# EAGLE board DistributedVisionSchematicPage1_3 4VER2 (EAGLE 9.6.2)
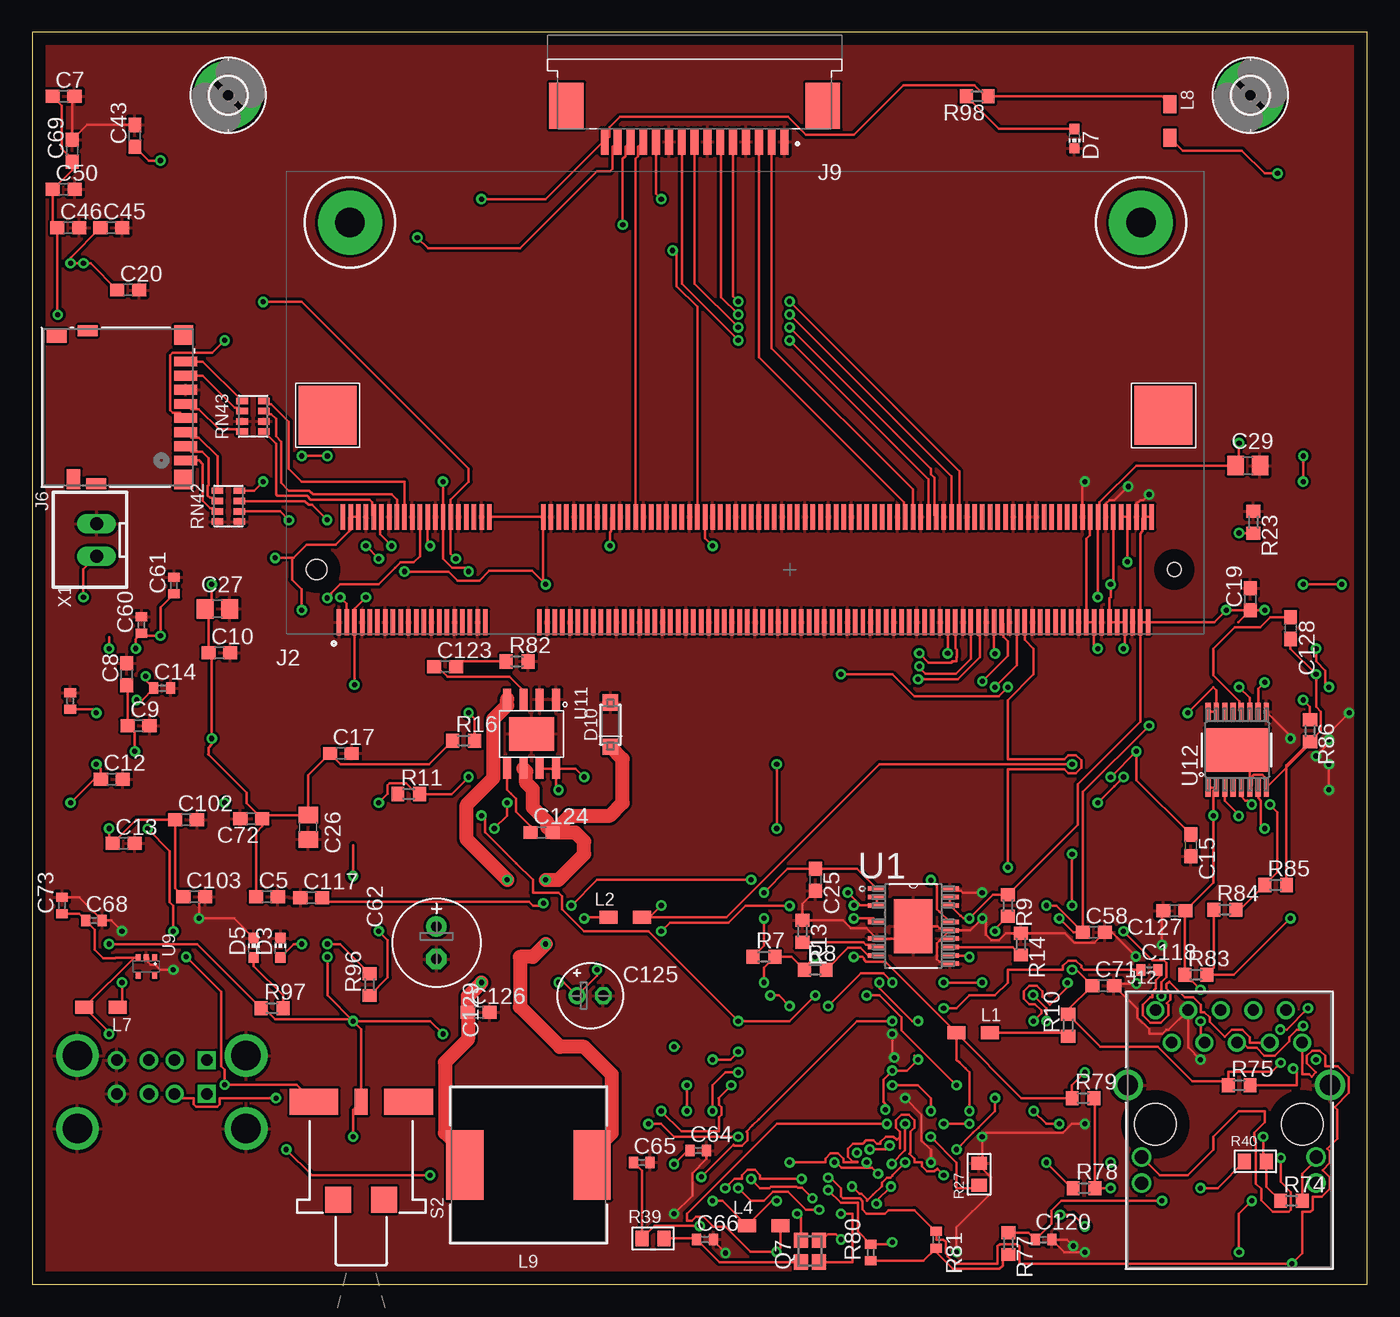
[diagram p4: board, top side]
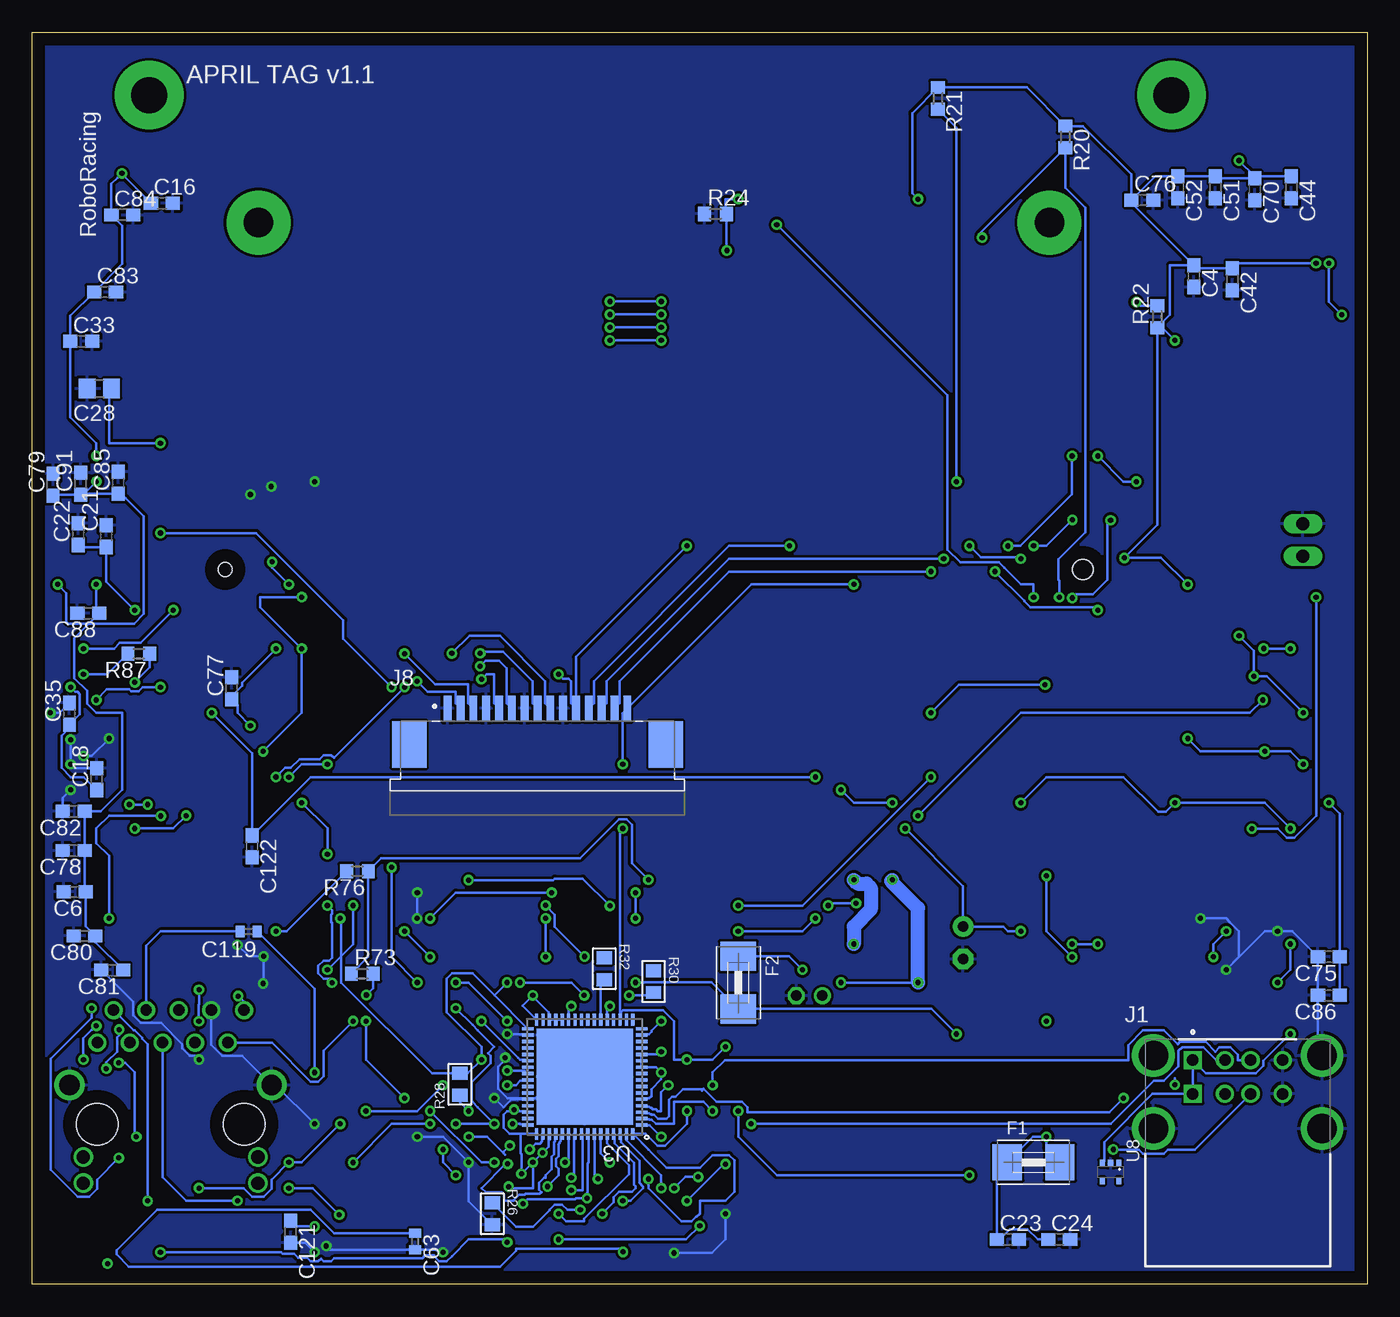
[diagram p5: board, bottom side, seen from below]

Size 104 x 97.5 mm. Coordinates in mm from the lower left corner, seen from the top.
Outline: 0,0 104,0 104,97.5 0,97.5 0,0
Copper layers (1*16): Top 0.035mm / dielectric 1.5mm / Bottom 0.035mm
Design rules "default": minimum track width 6mil, minimum drill 0.35mm, track to track 6mil, track to pad 6mil, pad to pad 6mil, via to via 6mil, smd to smd 6mil, copper to edge 40mil, drill to drill 6mil, minimum pad ring 10mil, minimum via ring 8mil, stop-mask expansion 4mil, vias tented up to drill 0mil, thermal gap 10mil
Net classes: 0 default: width 0.203 mm, drill 0.4 mm, clearance 0.203 mm; 1 power: width 0.203 mm, drill 0.4 mm, clearance 0.203 mm to class 0, clearance 0.203 mm; 2 ethernet: width 0.16 mm, drill 0.3 mm, clearance 0.152 mm; 3 spi: width 0.207 mm, drill 0.35 mm

## Footprints (pad centres in the part's own frame; a part is rotated, then mirrored left to right if it is on the bottom)
C0603 = smd 1.1 x 1: 1 -0.85,0; 2 0.85,0
C0402 = smd 0.7 x 0.9: 1 -0.65,0; 2 0.65,0
C0805 = smd 1.3 x 1.5: 1 -0.95,0; 2 0.95,0
E2-5 = drill 0.813 pad 1.27: + -1.016,0 | drill 0.813 pad 1.27 octagon: - 1.016,0
E2,5-7 = drill 0.813 pad 1.6: + -1.27,0 | drill 0.813 pad 1.6 octagon: - 1.27,0
CHIP-LED0603 = smd 0.8 x 0.8: A 0,-0.75; C 0,0.75
SOD123FL_DIO = smd 1.25 x 1.22: 1 -1.725,0; 2 1.725,0
1812 = smd 2.286 x 2.794: 1 -2.046,0; 2 2.046,0
2,8-PAD = drill 2.8 pad 5.334: B2,8 0,0
SAMTEC_USBR-A-D-F-O-TH = drill 0.9 square: A01 0,0; B01 0,-2.62 | drill 0.9: A02 2.5,0; A03 4.5,0; A04 7,0; B02 2.5,-2.62; B03 4.5,-2.62; B04 7,-2.62 | drill 2.3: S1 -3.07,0.35; S2 10.07,0.35; S3 10.07,-5.33; S4 -3.07,-5.33
TE_1473149-4_WITH_CM3PLUS = smd 0.35 x 2: 1 -35.1,-4.1; 2 -34.8,4.1; 3 -34.5,-4.1; 4 -34.2,4.1; 5 -33.9,-4.1; 6 -33.6,4.1; 7 -33.3,-4.1; 8 -33,4.1; 9 -32.7,-4.1; 10 -32.4,4.1; 11 -32.1,-4.1; 12 -31.8,4.1; 13 -31.5,-4.1; 14 -31.2,4.1; 15 -30.9,-4.1; 16 -30.6,4.1; 17 -30.3,-4.1; 18 -30,4.1; 19 -29.7,-4.1; 20 -29.4,4.1; 21 -29.1,-4.1; 22 -28.8,4.1; 23 -28.5,-4.1; 24 -28.2,4.1; 25 -27.9,-4.1; 26 -27.6,4.1; 27 -27.3,-4.1; 28 -27,4.1; 29 -26.7,-4.1; 30 -26.4,4.1; 31 -26.1,-4.1; 32 -25.8,4.1; 33 -25.5,-4.1; 34 -25.2,4.1; 35 -24.9,-4.1; 36 -24.6,4.1; 37 -24.3,-4.1; 38 -24,4.1; 39 -23.7,-4.1; 40 -23.4,4.1; 41 -19.5,-4.1; 42 -19.2,4.1; 43 -18.9,-4.1; 44 -18.6,4.1; 45 -18.3,-4.1; 46 -18,4.1; 47 -17.7,-4.1; 48 -17.4,4.1; 49 -17.1,-4.1; 50 -16.8,4.1; 51 -16.5,-4.1; 52 -16.2,4.1; 53 -15.9,-4.1; 54 -15.6,4.1; 55 -15.3,-4.1; 56 -15,4.1; 57 -14.7,-4.1; 58 -14.4,4.1; 59 -14.1,-4.1; 60 -13.8,4.1; 61 -13.5,-4.1; 62 -13.2,4.1; 63 -12.9,-4.1; 64 -12.6,4.1; 65 -12.3,-4.1; 66 -12,4.1; 67 -11.7,-4.1; 68 -11.4,4.1; 69 -11.1,-4.1; 70 -10.8,4.1; 71 -10.5,-4.1; 72 -10.2,4.1; 73 -9.9,-4.1; 74 -9.6,4.1; 75 -9.3,-4.1; 76 -9,4.1; 77 -8.7,-4.1; 78 -8.4,4.1; 79 -8.1,-4.1; 80 -7.8,4.1; 81 -7.5,-4.1; 82 -7.2,4.1; 83 -6.9,-4.1; 84 -6.6,4.1; 85 -6.3,-4.1; 86 -6,4.1; 87 -5.7,-4.1; 88 -5.4,4.1; 89 -5.1,-4.1; 90 -4.8,4.1; 91 -4.5,-4.1; 92 -4.2,4.1; 93 -3.9,-4.1; 94 -3.6,4.1; 95 -3.3,-4.1; 96 -3,4.1; 97 -2.7,-4.1; 98 -2.4,4.1; 99 -2.1,-4.1; 100 -1.8,4.1; 101 -1.5,-4.1; 102 -1.2,4.1; 103 -0.9,-4.1; 104 -0.6,4.1; 105 -0.3,-4.1; 106 0,4.1; 107 0.3,-4.1; 108 0.6,4.1; 109 0.9,-4.1; 110 1.2,4.1; 111 1.5,-4.1; 112 1.8,4.1; 113 2.1,-4.1; 114 2.4,4.1; 115 2.7,-4.1; 116 3,4.1; 117 3.3,-4.1; 118 3.6,4.1; 119 3.9,-4.1; 120 4.2,4.1; 121 4.5,-4.1; 122 4.8,4.1; 123 5.1,-4.1; 124 5.4,4.1; 125 5.7,-4.1; 126 6,4.1; 127 6.3,-4.1; 128 6.6,4.1; 129 6.9,-4.1; 130 7.2,4.1; 131 7.5,-4.1; 132 7.8,4.1; 133 8.1,-4.1; 134 8.4,4.1; 135 8.7,-4.1; 136 9,4.1; 137 9.3,-4.1; 138 9.6,4.1; 139 9.9,-4.1; 140 10.2,4.1; 141 10.5,-4.1; 142 10.8,4.1; 143 11.1,-4.1; 144 11.4,4.1; 145 11.7,-4.1; 146 12,4.1; 147 12.3,-4.1; 148 12.6,4.1; 149 12.9,-4.1; 150 13.2,4.1; 151 13.5,-4.1; 152 13.8,4.1; 153 14.1,-4.1; 154 14.4,4.1; 155 14.7,-4.1; 156 15,4.1; 157 15.3,-4.1; 158 15.6,4.1; 159 15.9,-4.1; 160 16.2,4.1; 161 16.5,-4.1; 162 16.8,4.1; 163 17.1,-4.1; 164 17.4,4.1; 165 17.7,-4.1; 166 18,4.1; 167 18.3,-4.1; 168 18.6,4.1; 169 18.9,-4.1; 170 19.2,4.1; 171 19.5,-4.1; 172 19.8,4.1; 173 20.1,-4.1; 174 20.4,4.1; 175 20.7,-4.1; 176 21,4.1; 177 21.3,-4.1; 178 21.6,4.1; 179 21.9,-4.1; 180 22.2,4.1; 181 22.5,-4.1; 182 22.8,4.1; 183 23.1,-4.1; 184 23.4,4.1; 185 23.7,-4.1; 186 24,4.1; 187 24.3,-4.1; 188 24.6,4.1; 189 24.9,-4.1; 190 25.2,4.1; 191 25.5,-4.1; 192 25.8,4.1; 193 26.1,-4.1; 194 26.4,4.1; 195 26.7,-4.1; 196 27,4.1; 197 27.3,-4.1; 198 27.6,4.1; 199 27.9,-4.1; 200 28.2,4.1 | smd 4.5 x 4.6: 201 -36,12; 202 29.1,12 | drill 2.3 pad 5: MH1 -34.25,27; MH2 27.35,27 | hole 1.6: -36.85,0 | hole 1.1: 29.95,0
CONN8_DM3D-SF_HIR = smd 0.762 x 1.803: 1 -4.149,-5.271; 2 -3.049,-5.271; 3 -1.949,-5.271; 4 -0.849,-5.271; 5 0.251,-5.271; 6 1.351,-5.271; 7 2.451,-5.271; 8 3.551,-5.271 | smd 1.499 x 1.499: 9 -5.625,-5.118; 10 5.625,-5.118 | smd 0.838 x 1.549: 11 -5.955,1.706; 12 5.955,2.356 | smd 1.549 x 1.041: 13 -5.6,3.46 | smd 1.041 x 1.549: 14 5.554,4.781
TE_1-84952-5 = smd 0.61 x 2: 1 -7,0; 2 -6,0; 3 -5,0; 4 -4,0; 5 -3,0; 6 -2,0; 7 -1,0; 8 0,0; 9 1,0; 10 2,0; 11 3,0; 12 4,0; 13 5,0; 14 6,0; 15 7,0 | smd 2.68 x 3.6: S1 -9.99,-2.8; S2 9.99,-2.8
CONN_EW_ABR = drill 0.89 pad 1.397: 1 5.715,0; 2 4.445,2.54; 3 3.175,0; 4 1.905,2.54; 6 -0.635,2.54; 7 -1.905,0; 8 -3.175,2.54; 9 -4.445,0; 10 -5.715,2.54 | drill 0.889 pad 1.397: 5 0.635,0 | drill 1.57 pad 2.083: CH1 -7.875,-3.3; CH2 7.875,-3.3 | drill 1.02 pad 1.524: L1 -6.8,-8.9; L2 -6.8,-10.93; L3 6.8,-8.9; L4 6.8,-10.93 | hole 3.25: 5.715,-6.35; -5.715,-6.35
0805 = smd 1.4 x 1: 1 -1.3,0; 2 1.3,0
WE-PD_1210 = smd 2.9 x 5.4: 1 -4.95,0; 2 4.95,0
FA-20H = smd 1.2 x 1.1: 1 -0.85,-0.7; 2 0.85,-0.7; 3 0.85,0.7; 4 -0.85,0.7
R0603 = smd 1 x 1.1: 1 -0.85,0; 2 0.85,0
RC0805N = smd 1.006 x 1.2: 1 -0.853,0; 2 0.853,0
R0402 = smd 0.7 x 0.9: 1 -0.65,0; 2 0.65,0
RA-4_1206 = smd 0.5 x 0.9: 1 -1.2,-0.85; 2 -1.2,0.85; 3 -0.4,-0.85; 4 -0.4,0.85; 5 0.4,-0.85; 6 0.4,0.85; 7 1.2,-0.85; 8 1.2,0.85
34EWMSP12M6RT = smd 3.81 x 2.03: 1 -3.685,0; 3 3.685,0 | smd 1.02 x 2.03: 2 0,0 | smd 2.03 x 2.03: LEG1 -1.78,7.62; LEG3 1.78,7.62
SOP65P640X175-21N = smd 1.422 x 0.356: 1 -2.845,2.921; 2 -2.845,2.286; 3 -2.845,1.626; 5 -2.845,0.33; 7 -2.845,-0.965; 8 -2.845,-1.626; 9 -2.845,-2.286; 11 2.845,-2.921; 12 2.845,-2.286; 13 2.845,-1.626; 14 2.845,-0.965; 15 2.845,-0.33; 16 2.845,0.33; 18 2.845,1.626; 19 2.845,2.286; 20 2.845,2.921 | smd 2.997 x 4.191: 21 0,0
QFN64_9X9MC_MCH-M = smd 0.908 x 0.255: 1 -4.442,3.75; 2 -4.442,3.25; 3 -4.442,2.75; 4 -4.442,2.25; 5 -4.442,1.75; 6 -4.442,1.25; 7 -4.442,0.75; 8 -4.442,0.25; 9 -4.442,-0.25; 10 -4.442,-0.75; 11 -4.442,-1.25; 12 -4.442,-1.75; 13 -4.442,-2.25; 14 -4.442,-2.75; 15 -4.442,-3.25; 16 -4.442,-3.75; 33 4.442,-3.75; 34 4.442,-3.25; 35 4.442,-2.75; 36 4.442,-2.25; 37 4.442,-1.75; 38 4.442,-1.25; 39 4.442,-0.75; 40 4.442,-0.25; 41 4.442,0.25; 42 4.442,0.75; 43 4.442,1.25; 44 4.442,1.75; 45 4.442,2.25; 46 4.442,2.75; 47 4.442,3.25; 48 4.442,3.75 | smd 0.255 x 0.908: 17 -3.75,-4.442; 18 -3.25,-4.442; 19 -2.75,-4.442; 20 -2.25,-4.442; 21 -1.75,-4.442; 22 -1.25,-4.442; 23 -0.75,-4.442; 24 -0.25,-4.442; 25 0.25,-4.442; 26 0.75,-4.442; 27 1.25,-4.442; 28 1.75,-4.442; 29 2.25,-4.442; 30 2.75,-4.442; 31 3.25,-4.442; 32 3.75,-4.442; 49 3.75,4.442; 50 3.25,4.442; 51 2.75,4.442; 52 2.25,4.442; 53 1.75,4.442; 54 1.25,4.442; 55 0.75,4.442; 56 0.25,4.442; 57 -0.25,4.442; 58 -0.75,4.442; 59 -1.25,4.442; 60 -1.75,4.442; 61 -2.25,4.442; 62 -2.75,4.442; 63 -3.25,4.442; 64 -3.75,4.442 | smd 7.493 x 7.493: 65 0,0
SC70-5 = smd 0.5 x 0.4: 1 -0.7,0.65; 2 -0.7,0; 3 -0.7,-0.65; 4 0.7,-0.65; 6 0.7,0.65
SOIC-8-EXPOSED_PAD = smd 1.6 x 0.61: 1 -2.7,1.905; 2 -2.7,0.635; 3 -2.7,-0.635; 4 -2.7,-1.905; 5 2.7,-1.905; 6 2.7,-0.635; 7 2.7,0.635; 8 2.7,1.905 | smd 2.62 x 3.51: 9 0,0
PWP0016H_N = smd 1.4 x 0.4: 1 -2.95,2.275; 2 -2.95,1.625; 3 -2.95,0.975; 4 -2.95,0.325; 5 -2.95,-0.325; 6 -2.95,-0.975; 7 -2.95,-1.625; 8 -2.95,-2.275; 9 2.95,-2.275; 10 2.95,-1.625; 11 2.95,-0.975; 12 2.95,-0.325; 13 2.95,0.325; 14 2.95,0.975; 15 2.95,1.625; 16 2.95,2.275 | smd 3.4 x 5: 17 0,0
JST-XH-02-PACKAGE-LONG-PAD = drill 1.016 long: 1 -1.17,-0.5; 2 1.37,-0.5

## Placement (x,y rotation side)
C4  10nF  [C0603]  13.53,78.5 270 bottom
C5  100nF  [C0603]  18.29,30.18 0 top
C6  100nF  [C0603]  100.68,30.56 180 bottom
C7  10uF  [C0603]  2.45,92.5 0 top
C8  10nF  [C0603]  7.37,47.5 90 top
C9  10nF  [C0603]  8.29,43.5 0 top
C10  100nF  [C0603]  14.59,49.18 0 top
C12  10uF  [C0603]  6.21,39.34 0 top
C13  10nF  [C0603]  7.13,34.34 0 top
C14  1uF  [C0402]  10.13,46.42 0 top
C15  100nF  [C0603]  90.24,34.18 270 top
C16  100nF  [C0603]  93.89,84.18 0 bottom
C17  10uF  [C0603]  24.05,41.34 0 top
C18  10nF  [C0603]  98.97,39.34 90 bottom
C19  10nF  [C0603]  94.89,53.34 90 top
C20  10nF  [C0603]  7.49,77.42 0 top
C21  100nF  [C0603]  98.22,58.26 90 bottom
C22  10uF  [C0603]  100.41,58.42 90 bottom
C23  22uF  [C0603]  28,3.5 0 bottom
C24  22uF  [C0603]  24,3.5 0 bottom
C25  470nF  [C0603]  61,31.5 270 top
C26  22uF  [C0805]  21.51,35.59 270 top
C27  22uF  [C0805]  14.43,52.59 0 top
C28  22uF  [C0805]  98.76,69.75 180 bottom
C29  22uF  [C0805]  94.68,63.75 0 top
C33  10nF  [C0603]  100.17,73.42 0 bottom
C35  10uF  [C0603]  101.09,44.42 90 bottom
C42  100nF  [C0603]  10.52,78.26 270 bottom
C43  4.7uF  [C0603]  8.01,89.42 90 top
C44  4.7uF  [C0603]  5.93,85.42 270 bottom
C45  100nF  [C0603]  6.17,82.26 0 top
C46  100nF  [C0603]  2.82,82.26 0 top
C50  100nF  [C0603]  2.47,85.26 0 top
C51  10nF  [C0603]  11.85,85.42 270 bottom
C52  10nF  [C0603]  14.77,85.42 270 bottom
C58  10nF  [C0603]  82.69,27.42 0 top
C60  100nF  [C0402]  8.52,51.34 90 top
C61  10nF  [C0402]  11.05,54.42 90 top
C62  4.7uF  [C0402]  2.97,45.42 90 top
C63  100nF  [C0402]  74.17,3.34 270 bottom
C64  1uF  [C0402]  51.89,10.42 0 top
C65  33pF  [C0402]  47.49,9.5 0 top
C66  33pF  [C0402]  52.41,3.5 0 top
C68  100nF  [C0402]  4.82,28.34 0 top
C69  100nF  [C0603]  3.12,88.26 90 top
C70  100nF  [C0603]  8.77,85.26 270 bottom
C71  100nF  [C0603]  83.42,23.26 0 top
C72  100nF  [C0603]  17.07,36.26 180 top
C73  10uF  [C0402]  2.33,29.5 90 top
C75  10nF  [C0603]  3,25.5 180 bottom
C76  10nF  [C0603]  17.53,84.42 0 bottom
C77  10nF  [C0603]  88.45,46.42 90 bottom
C78  100nF  [C0603]  100.76,33.78 180 bottom
C79  100nF  [C0603]  102.37,62.26 90 bottom
C80  10nF  [C0603]  99.92,27.13 180 bottom
C81  100nF  [C0603]  97.76,24.48 180 bottom
C82  100nF  [C0603]  100.76,36.83 180 bottom
C83  100nF  [C0603]  98.32,77.26 0 bottom
C84  100nF  [C0603]  96.97,83.26 0 bottom
C85  10nF  [C0603]  97.29,62.42 90 bottom
C86  10nF  [C0603]  3,22.5 180 bottom
C88  100nF  [C0603]  99.62,52.26 180 bottom
C91  100nF  [C0603]  100.22,62.34 90 bottom
C102  10uF  [C0603]  11.99,36.18 0 top
C103  10uF  [C0603]  12.64,30.18 0 top
C117  10000pF  [C0603]  21.75,30.1 0 top
C118  10000pF  [C0402]  87.02,24.48 0 top
C119  10000pF  [C0402]  87.13,27.48 180 bottom
C120  0.1uF  [C0402]  78.78,3.48 0 top
C121  10000pF  [C0603]  83.86,4.1 270 bottom
C122  10000pF, 50V  [C0603]  86.87,34.1 270 bottom
C123  0.022uF, 50V  [C0603]  32.17,48.1 0 top
C124  0.220uF  [C0603]  39.68,35.18 0 top
C125  100uF  [E2-5]  43.47,22.48 0 top
C126  0.220uF  [C0603]  34.79,21.18 0 top
C127  1uF, 50V  [C0603]  88.97,29.1 180 top
C128  2.2uF, 50V  [C0603]  98.01,51.1 270 top
C129  100uF, 35V  [E2,5-7]  31.5,26.59 270 top
D3  GRN  [CHIP-LED0603]  19.34,26.21 0 top
D5  GRN  [CHIP-LED0603]  17.26,26.21 0 top
D7  GRN  [CHIP-LED0603]  81.18,89.21 180 top
D10  NTS260ESFT3G  [SOD123FL_DIO]  45.04,43.58 90 top
F1  2A  [1812]  26,9.5 0 bottom
F2  2A  [1812]  49,23.5 270 bottom
H1  MOUNT-PAD-ROUND2.8  [2,8-PAD]  94.88,92.59 0 top
H2  MOUNT-PAD-ROUND2.8  [2,8-PAD]  15.26,92.59 0 top
J1  USBR-A-D-F-O-TH  [SAMTEC_USBR-A-D-F-O-TH]  13.6,17.46 0 bottom
J2  RASPBERRRY_COMPUTE_CM3  [TE_1473149-4_WITH_CM3PLUS]  59.01,55.66 0 top
J6  DM3D-SF  [CONN8_DM3D-SF_HIR]  6.69,68.3 90 top
J8  1-84952-5  [TE_1-84952-5]  64.64,44.84 0 bottom
J9  1-84952-5  [TE_1-84952-5]  51.6,88.97 180 top
J12  ARJM11C7-104-AB-EW2  [CONN_EW_ABR]  93.21,18.82 0 top
L1  4A  [0805]  73.29,19.58 0 top
L2  4A  [0805]  46.21,28.58 0 top
L4  1.3A 120r  [0805]  56.99,4.58 0 top
L7  1.3A 120r  [0805]  5.37,21.58 180 top
L8  1.3A 120r  [0805]  88.61,90.58 270 top
L9  47uH  [WE-PD_1210]  38.66,9.3 180 top
Q7  25 MHz  [FA-20H]  60.59,2.59 90 top
R7  5.1k  [R0603]  57,25.5 0 top
R8  47k  [R0603]  61,24.5 0 top
R9  47k  [R0603]  76,29.5 270 top
R10  31.6k  [R0603]  80.69,20.18 90 top
R11  12.7k  [R0603]  29.34,38.18 0 top
R13  10k  [R0603]  60,27.5 270 top
R14  10k  [R0603]  77,26.5 270 top
R16  4.7k  [R0603]  33.61,42.34 0 top
R20  4.7k  [R0603]  23.53,89.34 270 bottom
R21  4.7k  [R0603]  33.45,92.34 270 bottom
R22  4.7k  [R0603]  16.37,75.34 90 bottom
R23  100k  [R0603]  95.12,59.34 270 top
R24  100k  [R0603]  50.77,83.34 0 bottom
R26  12k, 1.0%  [RC0805N]  68.16,5.5 270 bottom
R27  12.4k, 1.0%  [RC0805N]  73.76,8.58 90 top
R28  4.7k  [RC0805N]  70.68,15.58 90 bottom
R30  4.7k  [RC0805N]  55.6,23.58 270 bottom
R32  4.7k  [RC0805N]  59.44,24.58 270 bottom
R39  1M  [RC0805N]  48.36,3.58 0 top
R40  4.7k  [RC0805N]  95.28,9.58 0 top
R73  75, 1%  [R0603]  78.28,24.18 0 bottom
R74  470  [R0603]  98.09,6.5 0 top
R75  470  [R0603]  94.01,15.5 0 top
R76  75, 1%  [R0603]  78.66,32.18 180 bottom
R77  22, 1%  [R0603]  76.04,3.18 270 top
R78  10k  [R0603]  81.93,7.5 0 top
R79  10k  [R0603]  81.85,14.5 0 top
R80  49.9, 1%  [R0402]  65.31,2.48 90 top
R81  49.9, 1%  [R0402]  70.42,3.48 270 top
R82  22k  [R0603]  37.77,48.5 0 top
R83  715k, 1%  [R0603]  90.64,24.1 0 top
R84  20k, 1%  [R0603]  92.9,29.18 0 top
R85  30.1k, 1%  [R0603]  96.85,31.1 0 top
R86  11.8k, 1%  [R0603]  99.53,43.1 270 top
R87  66.5k, 1%  [R0603]  95.69,49.1 180 bottom
R96  4.7k  [R0603]  26.29,23.34 90 top
R97  330  [R0603]  18.69,21.5 0 top
R98  470  [R0603]  73.61,92.5 180 top
RN42  22  [RA-4_1206]  15.29,60.59 90 top
RN43  22  [RA-4_1206]  17.21,67.59 90 top
S2  34EWMSP12M6RT  [34EWMSP12M6RT]  25.63,14.22 180 top
U1  LM26420XMH  [SOP65P640X175-21N]  68.64,27.89 0 top
U3  LAN9513-JZXQFN64_9X9MC_MCH-M  [QFN64_9X9MC_MCH-M]  60.96,16.16 180 bottom
U8  SP3003-02  [SC70-5]  20,8.75 270 bottom
U9  SP3003-02  [SC70-5]  8.9,24.75 270 top
U11  IFX91041  [SOIC-8-EXPOSED_PAD]  38.9,42.86 270 top
U12  TPS26600PWPR  [PWP0016H_N]  93.86,41.62 90 top
X1  JST-XH-02-PIN-LONG-PAD  [JST-XH-02-PACKAGE-LONG-PAD]  4.52,57.86 90 top

## Tracks (layer width: path | path; a pad name or v marks a point on that pad's centre or on a via)
3V3_LED
  Top 0.203: R98.2 75.3,89.96 D7.A
5V_LED
  Top 0.203: R97.2 19.54,22.5 17.26,24.78 D5.A
5V_RAW  (via drill 0.4)
  Top 0.203: 41.53,34.97 40.74,34.97 C124.2 | v40,31.5
  Top 1.1: L9.1 43.61,10.25 45.16,11.8 45.16,16.34 43,18.5 41.11,18.5 38,21.61 38,25.5 39,25.5 v40,26.5 | v40,31.5 41,31.5 43,33.5 43,34.5 42.32,35.18 C124.2 | C124.2 40.13,35.58 40.13,35.99 39,37.12 39,38.52 38.48,39.05 38.48,39.95 U11.6 | C124.2 41.85,36.5 45,36.5 46,37.5 46,40.9 D10.1
  Bottom 1.1: v40,31.5 39.71,31.21 39,31.21 38.67,30.88 38.67,29.19 40,27.86 v40,26.5
24_LOAD  (via drill 0.4)
  Top 0.203: U12.10 95.48,46.36 v96,46.88
  Bottom 0.203: v96,46.88 94.84,48.04 R87.1
24V_LED  (via drill 0.4)
  Top 0.203: D3.A 20.38,26.5 v21,26.5 | v23,26.5 23.98,26.5 R96.2
  Bottom 0.203: v23,26.5 v21,26.5
+1.8V  (via drill 0.4)
  Top 0.203: J2.184 82.39,59.74 82.39,58.33 82.11,58.05 J2.183 J2.185 82.71,49.79 v83,49.5 | v94,65.5 94,64.02 C29.1 85.99,63.75 83.13,60.89 83.13,59.88 J2.186 v83.01,53.52 v83,53.51 | v34,39.5 32.68,38.18 R11.2 29.97,38.18 29.12,39.03 27.86,39.03 27.69,38.86 27.69,38.19 v27,37.5 | v49,29.5 48.08,28.58 L2.2 54.08,28.58 66,40.5 v81,40.5 | C15.1 86,39.27 v86,41.5 v84,39.5 | v6,35.5 6,34.62 C13.1 8.12,36.18 C102.1 11.14,30.83 C103.1
  Bottom 0.203: v94,65.5 98,65.5 98,69.56 C28.1 | v34,39.5 44,29.5 v49,29.5 | v86,41.5 83,44.5 v83,49.5 86.23,52.73 86.23,53.5 v83.01,53.5 v83,53.51 | v81,40.5 83,40.5 v84,39.5 | v6,35.5 8,37.5 v14.99,37.5 v15,37.5 15.71,36.79 16.29,36.79 19,39.5 25,39.5 v27,37.5
+3.3V  (via drill 0.4)
  Top 0.203: L8.1 87.99,92.5 R98.1 74.24,92.5 73.39,93.36 67.86,93.36 64,89.5 60.29,89.5 58.88,90.91 45.8,90.91 44.99,90.1 44.99,89.36 J9.15 44.47,88.97 40,84.5 v35,84.5 | C20.1 4.56,79.5 v4,79.5 v3,79.5 3,79.94 C45.1 | 1.97,75.47 v2,75.5 1.97,75.53 C46.1 1.62,82.61 C50.1 3.12,86.76 C69.1 3.12,87.63 2.31,88.43 2.31,91.78 C7.1 | J2.4 24.69,59.64 24.69,58.63 | 20.36,56.57 21.37,57.58 23.63,57.58 24.69,58.63 | 20.36,56.57 v18.93,56.57 | v14,54.5 14,53.11 C27.1 13.74,52.33 C10.1 14,48.92 v14,42.5 14,42.06 13.74,41.8 13.74,41.24 | 20.36,56.57 20.24,56.45 20.24,54.87 21,54.11 v21,52.5 | J2.4 24.81,58.75 24.69,58.63 | v29,55.5 32.42,55.5 33.13,54.79 34.84,54.79 35.61,55.56 38.94,55.56 v40,54.5 39.81,54.69 J2.42 J2.40 | v58,35.5 v58,40.5 | C58.1 81.84,38.34 v87,43.5 | R74.1 96.13,7.61 R40.2 95.88,9.83 v95.88,11.5 | C58.1 79.76,29.5 v79,29.5 | v81,24.5 81.33,24.5 C71.1 80.69,21.38 R10.2 83.22,18.5 87.67,18.5 90.35,15.82 92.84,15.82 R75.1 93.16,16.56 96.55,16.56 v97.24,17.26 | C58.1 81.08,27.42 v80,28.5 | C72.1 18.2,36.54 C26.1 21.51,39.65 C17.1 24.04,40.5 30.92,40.5 R16.1 | C72.1 16.71,37.47 16.71,38.27 13.74,41.24 | C72.1 17.92,35.66 17.44,35.18 C5.1 | v52.99,13.5 52.99,15.5 54,16.51 v54.99,16.51 v55,16.5 | 68.71,17.79 v69,17.5 68.14,16.64 v67,16.64 66.29,15.94 66.29,14.21 66.46,14.04 v66.46,13.61 | J2.4 J2.6 | J2.190 84.21,54.71 v84,54.5 84,53.5 83.91,53.41 J2.189 J2.191 J2.193 85.11,49.61 v85,49.5 | v85.3,56.25 85.3,59.65 J2.194 J2.192 | C43.1 9.08,87.5 v10,87.5 | J6.4 11.55,67.87 10.93,67.87 10.75,68.04 10.75,72.36 10.93,72.54 14.04,72.54 v15,73.5 | v8,41.5 8,42.94 C9.1 7.44,46.58 C8.1
  Top 0.203: v5,40.5 5.36,40.14 C12.1 4.84,39.34 v3,37.5 | 13.74,41.24 13.71,41.27 | v67.01,23.5 v67,23.5 66.29,24.21 64.55,24.21 v62,21.66 | v55,18.12 54.38,17.5 v53,17.5 | 50.38,18.5 v50,18.5 | v56,8.21 56.71,7.5 57.42,7.5 57.54,7.61 59.53,7.61 59.64,7.51 59.97,7.51 v60.78,6.71 | v65.77,6.27 65.77,6.5 v66.89,7.61 | v62.49,9.5 62.62,9.5 63.03,9.09 65.41,9.09 v65.89,8.62
  Bottom 0.203: v35,84.5 35.45,84.95 35.45,91.19 R21.1 26.53,93.19 R20.1 22.15,90.19 18.38,86.42 C76.1 | C76.1 16.53,86.27 C52.1 C51.1 11.69,86.11 C70.1 | C44.1 8.61,86.27 C70.1 | v4,79.5 10.13,79.5 C42.1 13.29,79.11 C4.1 | C76.1 18.38,84.2 C4.1 | C4.1 15.37,79.35 15.37,75.49 R22.1 | v3,79.5 3,76.5 v2,75.5 | R22.1 16.37,59.13 v18.93,56.57 16.07,56.57 v14,54.5 | v40,54.5 47.98,54.5 J8.15 58,44.48 v58,40.5 | v21,52.5 21.23,52.73 26.23,52.73 26.71,53.21 v29,55.5 | v58,35.5 58.21,35.29 U3.19 58.14,20.67 58.14,21.18 57.96,21.36 54.86,21.36 54,20.5 54,17.5 v53,17.5 51,17.5 v50,18.5 | 55.99,10.5 U3.64 | v85,49.5 87.64,46.85 87.64,46.59 88.45,45.79 C77.1 88,45.12 88,44.5 v87,43.5 | v79,29.5 79,26.5 v81,24.5 | v80,28.5 79.94,28.43 79.94,23.5 72.86,16.43 R28.2 70.07,16.43 v69,17.5 69,18.5 71.71,21.21 71.71,23.79 71.29,24.21 69.7,24.21 68,22.5 | v62,21.66 62.21,21.45 U3.27 | 66,13.5 67,13.5 67.29,13.21 67.29,12.21 66.8,11.72 66,11.72 | 66,13.5 65.98,13.48 65.47,13.48 U3.46 | U3.64 56.22,11.72 55.29,10.79 54.71,10.79 52.99,12.51 v52.99,13.5 | v67,16.64 65.64,16.64 U3.40 U3.39 | v84,54.5 85.3,55.8 v85.3,56.25 | U3.64 54.58,9.08 51.99,9.08 51,10.07 49.71,10.07 49.29,9.66 49.29,7.21 50,6.5 52,6.5 52,5.5 52.24,5.26 52.29,5.26 52.63,4.93 53.43,4.93 56,7.5 v56,8.21 | 60.64,9.5 | 60.64,9.5 60.64,11.65 U3.57 | v62.49,9.5 62.21,9.78 U3.54 | 66,13.5 66.11,13.61 v66.46,13.61 | U3.51 63.71,11.28 63.76,11.23 63.76,10.73 v64.24,10.25 v64.25,10.25 v65,9.5 | v10,87.5 8.77,86.27 C70.1 | v15,73.5 15.99,74.49 R22.1 | v14,42.5 13,41.5 v8,41.5 6,41.5 v5,40.5 | v95.88,11.5 96,11.62 96,16.5 96.76,17.26 v97.24,17.26
  Bottom 0.203: U3.33 68,22.5 | v67.01,23.5 68,22.51 68,22.5 | v55,18.12 55.21,17.91 U3.12 U3.11 U3.10 55.41,16.91 v55,16.5 55,15.96 55.76,15.2 55.76,14.66 55.94,14.48 56.45,14.48 U3.5 | 60.64,9.5 60.74,9.41 60.74,7.17 60.78,7.13 v60.78,6.71 61.64,6.71 61.71,6.63 65.41,6.63 v65.77,6.27 | C86.1 C75.1 2.15,36.65 v3,37.5 | v65,9.5 65,7.5 66.77,7.5 v66.89,7.61 | v65,9.5 v65.89,8.62 65.89,10.14 65.96,10.22 65.96,11.68 66,11.72 | 66,11.72 U3.49
+3.3V-A  (via drill 0.4)
  Top 0.203: v99,54.5 v102,54.5 | L8.2 89.61,88.28 94.22,88.28 96,86.5 v97,86.5 | v99,62.5 v99,64.49 v99.01,64.5
  Bottom 0.203: v99,54.5 99,52.49 C88.1 100.71,50.32 100.71,47.21 99.71,46.21 99.71,45.21 99,44.5 97,44.5 97,38.5 98.67,36.83 C82.1 C78.1 99.91,30.64 C6.1 99.83,27.89 C80.1 99.07,26.64 C81.1 | C91.1 102.29,61.49 C79.1 102.17,61.21 | C91.1 100.14,61.57 C85.1 97.07,61.57 96.71,61.21 95.29,59.79 95.29,52.21 96.04,51.45 101.15,51.45 101.33,51.63 101.33,53.83 v102,54.5 | C91.1 100.01,61.49 v99,62.5 | v99.01,64.5 99.01,65.49 101.02,67.5 C33.1 101.02,75.41 C83.1 96.97,79.47 96.97,82.41 C84.1 97.82,85.68 97.32,86.18 v97,86.5 97,86.44 C16.1
+3V3_A
  Top 0.203: R81.2 69.42,1.83 R80.1 | R81.2 70,2.41 | R77.2 75.59,1.88 75.59,1.45 75.35,1.21 71.71,1.21 70.42,2.5 R81.2
+5V  (via drill 0.4)
  Top 0.203: v25,31.81 25,34.2 | v25,20.5 23,22.5 v23,25.49 | L7.1 7,21.91 v7,23.5 | v6,26.5 12.84,26.5 R97.1 18.06,21.5 18.91,20.64 24.86,20.64 v25,20.5 | C19.1 93.96,51.56 | C19.1 v96,52.5 | v101,46.5 100.71,46.79 100.71,47.79 100,48.5 v100,49.5 | C19.1 v93,52.5 92.06,51.56 J2.199 J2.197 | J2.197 86.31,58.45 86.49,58.63 86.49,59.64 J2.198 J2.200 | U1.19 U1.18 72.3,28.7 72.32,28.7 72.53,28.5 v73,28.5 74.85,30.35 R9.1 81.43,35.78 81.43,38.94 86.31,43.81 J2.197 | U1.3 64.52,29.52 v63.53,30.5 | v25,20.5 25.63,19.87 S2.2 25,13.59 v25,11.5 | v25,20.5 31,20.5 v32,19.5 | v57,23.5 57,24.65 R7.2 59.15,25.5 R8.1 60.15,24.71 v60.97,25.53 | v64,29.51 U1.3 | U1.3 U1.2
  Bottom 0.203: v7,23.5 6,24.5 v6,26.5 | v23,25.49 25,27.49 v25,31.81 | C22.1 100.57,57.41 C21.1 98.22,54.72 v96,52.5 | v101,46.5 100.63,46.12 100.46,46.12 100.28,45.95 100.28,44.38 C35.1 101.09,43.33 101.71,42.71 101.71,40.21 101,39.5 99.98,39.5 C18.1 | v100,49.5 97.62,49.5 97.17,49.95 95.55,49.95 v93,52.5 | v63.53,30.5 71,30.5 v73,28.5 | v32,19.5 33.95,21.45 F2.2 51.08,23.54 56.33,23.54 56.36,23.5 v57,23.5 | C24.1 25.67,3.5 26.47,4.3 27.83,4.3 28.63,3.5 C23.1 28.85,8.7 F1.1 26.05,11.5 v25,11.5 25,10.55 F1.2 | v60.97,25.53 63.29,27.85 63.29,28.79 v64,29.5 v64,29.51
+5V_PREFUSE  (via drill 0.4)
  Top 0.203: v41,23.5 41.43,23.5 C125.+ 44,24.03 v44,24.5
  Top 1.1: L9.2 33.71,10.25 32.16,11.8 32.16,17.3 33.94,19.07 C126.1 33.94,22.44 v35,23.5 | v37,31.5 33.84,34.66 33.84,37.34 35.94,39.44 35.94,44.03 36.99,45.09 U11.4
  Bottom 0.203: v41,23.5 v35,23.5 | v44,24.5 45.05,25.55 F2.1
  Bottom 1.1: v35,23.5 35,29.29 37.1,31.4 v37,31.5
+24V  (via drill 0.4)
  Top 0.203: U12.7 95.48,37.88 95.71,37.66 95.71,35.79 v96,35.5 | U12.1 U12.2 92,38.44 v92,36.5 92,31.28 C127.1 89.79,29.07 R83.1 90.31,23.59 90.36,23.59 v91,22.94 | J12.7 91.01,19.11 v91.01,20.49
  Bottom 0.203: v96,35.5 93,35.5 v92,36.5 | v91,22.94 91,21.81 91.04,21.78 91.04,20.94 91.01,20.92 v91.01,20.49
+24V_FUSE  (via drill 0.4)
  Top 0.203: U11.7 U11.8 | U11.8 42.34,40.16 v43,39.5 | v36,35.5 37,36.5 v37,37.5 | v41,38.5 40.8,38.7 U11.8 | v90,44.5 92,46.5 92.23,46.27 U12.15 U12.16 | v27,27.51 v27,27.5 27.71,26.79 27.71,23.91 R96.1
  Bottom 0.203: v43,39.5 82.32,39.5 C122.1 86.87,41.37 v90,44.5 | v36,35.5 31.5,31 C129.+ 28.36,27.86 28.01,27.51 v27,27.51 | v37,37.5 40,37.5 v41,38.5
BVCC  (via drill 0.4)
  Top 0.203: X1.1 4,55.67 v4,53.5 | S2.3 20.62,15.55 v15,15.55 15,16.7 14.71,17 14.71,22.79 v12,25.5 | v11,27.5 11,29.49 10.73,29.75 10.73,33.74 v9,35.47
  Bottom 0.203: 15,16.06 v15,15.55 | v12,25.5 12,26.5 v11,27.5 | v9,35.47 6.97,35.47 6.29,34.79 5.71,34.79 4,36.5 v4,53.5
CAM0_CN  (via drill 0.4)
  Top 0.203: J2.144 70.29,59.88 70.29,62.78 70,63.08 70,63.51 v59,74.51 | v55,74.51 51.6,77.91 J9.8
  Bottom 0.203: v59,74.51 v55,74.51
CAM0_CP  (via drill 0.4)
  Top 0.203: J2.142 69.81,62.69 v59,73.5 | v55,73.5 50.6,77.9 J9.9
  Bottom 0.203: v59,73.5 v55,73.5
CAM0_DN0
  Top 0.203: J2.138 68.61,61.89 57.6,72.9 J9.2
CAM0_DN1  (via drill 0.4)
  Top 0.203: J2.150 72.21,63.32 v59,76.53 | v55,76.53 54.6,76.93 J9.5
  Bottom 0.203: v59,76.53 v55,76.53
CAM0_DP0
  Top 0.203: J2.136 67.89,59.88 67.89,60.89 56.6,72.18 J9.3
CAM0_DP1  (via drill 0.4)
  Top 0.203: J2.148 71.61,62.91 v59,75.52 | J9.6 53.66,88.97 53.66,76.86 v55,75.52
  Bottom 0.203: v59,75.52 v55,75.52
CAM0_IO0  (via drill 0.4)
  Top 0.203: J9.11 48.6,84.9 v49,84.5 | J2.82 51.81,76.11 50.19,77.73 50.19,80.2 v49.89,80.5
  Bottom 0.203: v49,84.5 50,84.5 50,83.42 R24.2 49.92,80.53 v49.89,80.5
CAM0_IO1
  Top 0.203: J9.12 47.21,88.58 47.21,87.84 47.01,87.64 J2.66
CAM0_SCL  (via drill 0.4)
  Top 0.203: v26,53.5 25.11,52.61 J2.5 v25.11,46.69 | J9.13 46.21,88.58 46.21,87.84 46,87.63 v46,82.5 | v34,44.5 34.46,44.04 R16.2
  Bottom 0.203: v46,82.5 32.71,69.21 32.71,57.21 31.71,56.21 28.71,56.21 28.29,55.79 27,54.5 26,54.5 v26,53.5 | v25.11,46.69 31.81,46.69 v34,44.5
CAM0_SDA  (via drill 0.4)
  Top 0.203: J9.14 45.21,88.58 45.21,86.84 45.03,86.67 44,86.67 38,80.67 30.84,80.67 v30,81.5 | v24,53.5 24.51,52.99 J2.3
  Bottom 0.203: v30,81.5 30.26,81.76 R20.2 23.53,85.4 21.95,83.82 21.95,58.58 24.08,56.45 24.08,54.87 24,54.79 v24,53.5
CAM1_CN  (via drill 0.4)
  Top 0.203: v69.1,49.14 69.82,48.42 71.6,48.42 71.68,48.5 72,48.5 72,48.82 72.02,48.83 72.02,49.42 71.91,49.53 J2.149
  Bottom 0.203: J8.8 65.03,45.23 65.03,46.97 67.32,49.26 68.98,49.26 v69.1,49.14
CAM1_CP  (via drill 0.4)
  Top 0.203: v71.31,49.13 J2.147
  Bottom 0.203: J8.9 64.03,45.23 64.03,46.97 67.56,50.5 69.94,50.5 v71.31,49.13
CAM1_DN0  (via drill 0.4)
  Top 0.203: J2.161 75.63,51.44 75.63,50.43 76,50.06 76,48.95 v74.01,46.96
  Bottom 0.203: J8.2 71.03,45.23 71.03,46.15 73.19,46.15 v74.01,46.96
CAM1_DN1  (via drill 0.4)
  Top 0.203: v69,47.12 72.1,47.12 73.82,48.83 73.82,50.42 73.71,50.53 J2.155
  Bottom 0.203: J8.5 68.03,45.23 68.03,47.47 68,47.5 68.62,47.5 v69,47.12
CAM1_DP0  (via drill 0.4)
  Top 0.203: v75,49.11 74.91,49.2 J2.159
  Bottom 0.203: J8.3 70.03,45.23 70.03,46.73 72.63,46.73 v75,49.11
CAM1_DP1  (via drill 0.4)
  Top 0.203: J2.153 73.11,48.7 71.95,47.55 69.57,47.55 69.29,47.83 69,47.83 69,48.02 v69.11,48.13
  Bottom 0.203: J8.6 67.03,45.23 67.03,47.97 67.61,48.55 68.69,48.55 v69.11,48.13
CAM1_IO0  (via drill 0.4)
  Top 0.203: v53,57.5 52.41,58.09 J2.84 | v63,47.5 67,47.5 68.71,45.79 75.29,45.79 v76,46.5 | v94,58.5 R23.2
  Bottom 0.203: v53,57.5 61.64,48.86 J8.11 62.03,45.23 62.03,46.97 62.21,47.15 62.64,47.15 v63,47.5 | v94,58.5 86.55,58.5 79.77,51.73 79.77,50.27 v76,46.5
CAM1_IO1  (via drill 0.4)
  Top 0.203: v45,57.5 45,58.54 45.09,58.63 45.09,59.64 J2.60
  Bottom 0.203: J8.12 60.25,45.23 60.25,46.97 49.72,57.5 v45,57.5
CAM1_SCL  (via drill 0.4)
  Top 0.203: v18,76.5 21,76.5 34,63.5 34,62.5 32.61,61.11 J2.30 32.61,56.89 v33,56.5
  Bottom 0.203: v18,76.5 17.69,76.19 R22.2 | J8.13 59.25,45.23 59.25,46.97 49.72,56.5 v33,56.5
CAM1_SDA  (via drill 0.4)
  Top 0.203: v32,62.5 J2.28 32.01,56.49 32.71,55.79 33.71,55.79 v34,55.5
  Bottom 0.203: R21.2 32,90.04 v32,62.5 | J8.14 58.25,45.23 58.25,46.97 49.72,55.5 v34,55.5
CT  (via drill 0.4)
  Top 0.203: R77.1 77.58,4.03 C120.1 79.37,4.72 79.37,5.72 80.16,6.51 v88,6.51 | v99,20.12 98.7,19.82 98.51,19.82 97.92,19.24 97.92,18.94 96.8,17.82 95.97,17.82 95.37,18.41 94.68,18.41 94.27,18.82 J12.5
  Bottom 0.203: v88,6.51 92.01,6.51 93.84,8.35 J12.5 | v99,20.12 99.3,19.82 99.34,19.82 100,19.16 v100,17.5
FB1
  Top 0.203: L1.2 80.44,19.58 R10.1
G_LED+  (via drill 0.4)
  Top 0.203: v97.24,9.85 97.24,7.98 98.05,7.18 98.05,5.82 97.87,5.64 96.61,5.64 95.73,6.53 95.73,7.44 95.33,7.84 95.33,11.05 95.17,11.21 95.17,11.79 96,12.62 96,13.5 93.99,13.5 92,11.5 92,10.5 90,8.5 87.83,8.5 J12.L1 | v99.37,21.5 97.7,19.84 v97.21,19.84 | v98.22,16.8 98.52,16.5 98.52,15.5 R75.2
  Bottom 0.203: v99.37,21.5 99.37,20.76 102.57,17.56 102.57,8.93 100.45,6.82 99.57,6.82 98.94,7.45 98.94,8.15 v97.24,9.85 | v97.21,19.84 97.21,19.41 97.39,19.24 97.39,18.11 98.22,17.28 v98.22,16.8
GND  (via drill 0.4)
  Top 0.203: J2.182 81.81,62.31 v82,62.5 | v85.37,62.13 84.31,61.06 83.91,61.06 83.61,60.77 J2.188 | v87,61.5 86.56,61.06 86.31,61.06 86.01,60.77 J2.196 | v70,9.5 70,10.48 69.28,11.2 69.28,13.22 v68,14.5 | 73.91,9.59 74,9.67 v74,11.5 74.29,11.79 80.29,11.79 81,12.5 v82,12.5 | 73.91,9.59 R27.2 | v82,2.5 80.41,2.5 C120.2 80.6,3.48 v81.09,2.99 | v72,2.5 72,4.43 74.67,7.1 74.67,8.36 73.91,9.11 73.91,9.59 | v91,17.5 90.03,18.46 J12.8 88.5,19.82 88.35,19.82 88.03,19.5 87,19.5 87,19.86 86.08,20.78 86.08,21.45 C71.2 84.43,23.42 v86,23.42 | C43.2 4.28,90.27 C69.2 3.12,92.32 C7.2 | C73.2 3.66,30.15 C68.2 6.17,28.34 v7,27.51 | v11,24.5 9.98,24.5 9.59,24.89 9.22,24.89 9.05,25.07 9.05,25.3 U9.2 | C103.2 13,29.69 v13,28.5 15.72,28.5 D5.C | v50,5.5 51.42,6.92 51.42,8.67 52.54,9.79 C64.2 | v54,2.45 53.06,3.39 C66.2 | C25.2 60,29.65 R13.1 63.15,28.35 63.76,27.74 64.98,27.74 U1.7 67.67,26.93 U1.21 70.5,27.89 70.65,27.74 71.31,27.74 U1.15 | U1.11 71.33,25.12 70.65,25.12 70.47,25.3 70.47,26.57 70.65,26.75 70.67,26.75 U1.15 | U1.15 73.07,27.56 v74.01,28.5 74.29,28.22 74.29,27.21 74.71,26.79 75.29,26.79 75.85,27.35 R14.1 80.43,27.35 81.16,26.61 82.73,26.61 C58.2 84.08,27.42 v85.96,25.54 | v74,30.5 72.48,30.5 72.32,30.66 71.64,30.66 U1.20 | v88,26.42 88,28.98 C127.2 | v101,38.5 v101,40.5 | v102.58,44.5 101,42.92 v101,42.41 101,42.14 v100,41.14 | U12.9 98,42.7 v98,42.5 | v67.16,17.65 66.99,17.82 v66.99,19.49
  Bottom 0.203: U3.44 65.33,14.48 64.82,14.48 63.14,16.16 U3.65 | 67.98,14.48 v68,14.5 67.29,13.79 66.67,14.41 U3.44 | v74,11.5 72,11.5 v70,9.5 70,6.49 R26.2 | C121.2 82.75,3.25 v82,2.5 | v81.09,2.99 80.78,2.69 C63.2 72.54,2.69 72.35,2.5 v72,2.5 | v82,12.5 85.02,15.52 J12.CH1 87.63,17.82 89.18,17.82 90.03,18.67 J12.8 | v91,17.5 91.32,17.82 91.72,17.82 92.31,18.4 92.31,18.7 93.96,20.36 95.53,20.36 96.12,20.94 96.12,21.99 C81.2 | J1.S2 3.85,18.13 C86.2 C75.2 5.86,27.51 v7,27.51 7.99,27.51 v11,24.5 10,25.5 10,27.5 10.71,28.21 11,28.5 v13,28.5 | v50,5.5 50,3.5 51.05,2.45 v54,2.45 | v74.01,28.5 v74,28.51 v74,30.5 | v86,23.42 85.96,23.46 v85.96,25.54 87.11,25.54 v88,26.42 | C82.2 101.61,37.89 v101,38.5 | C18.2 100.69,40.19 v101,40.5 v101,42.41 | v102.58,44.5 101.86,44.5 C35.2 | v98,42.5 99.36,41.14 v100,41.14 | U3.44 65.47,14.48 66.97,14.48 67.71,15.22 67.71,16.94 67.16,17.49 v67.16,17.65 | v66.99,19.49 66,19.49 65.98,19.48 65.47,19.48 U3.34
  pour Top: 0,0.5 0,97.5 104,97.5 104,1.5 103,0.5
  pour Bottom: 0,0.5 0,97.5 103,97.5 104,96.5 104,2.5 102,0.5
N$3
  Top 0.203: U1.8 65.62,26.44 64.96,26.44 64.75,26.65 R13.2
N$4
  Top 0.203: U11.3 38.27,46.23 37.2,47.3 32.34,47.3 31.54,48.1 C123.1
N$5  (via drill 0.4)
  Top 0.203: R7.1 57,26.35 v57,28.5 | v57,30.5 58.85,32.35 C25.1 64.26,32.35 U1.1
  Bottom 0.203: v57,28.5 v57,30.5
N$10  (via drill 0.4)
  Top 0.203: v77.97,22.54 79,21.5 v79,20.5
  Bottom 0.203: R73.2 77.43,23.07 v77.97,22.54 | v79,20.5 81.29,18.21 81.29,16.21 81.71,15.79 82.29,15.79 85.32,18.82 J12.9
N$14  (via drill 0.4)
  Top 0.203: v85,27.5 87.27,25.23 88.15,25.23 88.33,25.06 88.33,23.9 87.95,23.53 v87.95,22.45
  Bottom 0.203: R76.2 84.19,27.5 v85,27.5 | J12.10 87.5,21.99 v87.95,22.45
N$15
  Top 0.203: U11.5 37,38.5 37.29,38.21 37.71,37.79 37.71,36.79 38.83,35.67 C124.1
N$16
  Top 0.203: C123.2 33.42,48.5 R82.1
N$20  (via drill 0.4)
  Top 0.203: C117.2 22.91,29.79 38.7,29.79 39,29.5 39.65,29.5 v39.83,29.67 | v42,29.5 44,31.5 v56,31.5
  Bottom 0.203: R73.1 77.81,25.5 R76.1 76.81,33.18 61.32,33.18 58.29,36.21 57.71,36.21 57.29,35.79 57.29,32.79 v56,31.5 | v42,29.5 41.83,29.67 v39.83,29.67
N$25  (via drill 0.4)
  Top 0.203: R84.1 92.05,24.66 R83.2 93.6,24.1 v98,28.5 | U12.3 92.89,37.67 93.97,36.58 v93.97,36.47
  Bottom 0.203: v93.97,36.47 94,36.5 98,36.5 99,35.5 99,34.36 98,33.36 v98,28.5
N$28  (via drill 0.4)
  Top 0.203: R84.2 94.08,29.18 R85.1 97,32.1 97,36.78 v96.42,37.36 | v95,37.36 94.7,37.66 94.51,37.66 94.19,37.99 U12.5
  Bottom 0.203: v95,37.36 v96.42,37.36
N$29
  Top 0.203: U12.12 94.04,44.72 94.04,45.4 92,47.44 92,49.5 93.65,51.15 95.66,51.15 96.45,51.95 C128.1
N$34  (via drill 0.4)
  Top 0.203: U12.11 94.83,45.66 v94,46.5 | v99,45.5 99.53,44.97 R86.1
  Bottom 0.203: v94,46.5 95.38,46.5 95.71,46.17 96.29,46.17 96.45,46.33 98.17,46.33 v99,45.5
N$40
  Top 0.203: U1.9 65.14,25.6 64.53,26.21 63.56,26.21 R8.2
N$46
  Top 0.203: RN42.4 14.2,60.44 13.86,60.44 13.28,61.02 13.28,63.87 13,64.15 J6.1
N$47
  Top 0.203: RN42.6 14.2,61.23 13.86,61.23 13.68,61.41 13.68,62.17 13.76,62.24 13.76,64.32 13.24,64.84 12.38,64.84 J6.2
N$48
  Top 0.203: J6.3 12.38,65.94 12.99,65.94 14.44,64.48 RN42.8
N$49
  Top 0.203: RN43.2 16.18,66.57 14.55,66.57 12.99,68.14 12.38,68.14 J6.5
N$50
  Top 0.203: RN43.6 16.11,68.23 15.78,68.23 13.27,70.75 J6.7
N$51
  Top 0.203: J6.8 13.3,71.85 RN43.8
N$55  (via drill 0.4)
  Top 0.203: v58,6.5 57.61,6.5 L4.1 53.77,6.5 v53,6.5 | C64.1 51.06,10.42 v50,9.36
  Bottom 0.203: U3.62 58.14,11.65 58.14,11.06 56.71,9.63 56.71,7.91 56.41,7.61 56.41,7.5 57.41,6.5 v58,6.5 | v50,9.36 50.14,9.36 v53,6.5
N$56  (via drill 0.4)
  Top 0.203: v66.58,12.5 58,12.5 51,5.5 51,4.96 51.41,4.96 51.71,5.26 52.29,5.26 53.06,4.5 54,4.5 55.97,2.53 v57.97,2.53 58.29,2.85 L4.2
  Bottom 0.203: U3.48 65.47,12.48 65.98,12.48 66,12.5 v66.58,12.5 | v57.97,2.53 58.23,2.79 66.29,2.79 66.29,2.63 67.54,1.39 96.46,1.39 97.41,2.33 97.41,2.67 94.27,5.8 82.29,5.8 80.48,3.99 C63.1
N$58  (via drill 0.4)
  Top 0.203: v59,21.66 58.16,22.5 v57.5,22.5
  Bottom 0.203: U3.21 59.21,21.45 v59,21.66 | v57.5,22.5 55.83,22.5 R30.2
N$59
  Bottom 0.203: U3.22 59.71,23.46 R32.2
N$63  (via drill 0.4)
  Top 0.203: v80,12.5 79,12.5 v78,13.5 | v72,15.5 67.71,19.79 67.71,20.79 66,22.5 v65,22.5 | v91,7.5 92.35,7.5 R40.1
  Bottom 0.203: v80,12.5 83,9.5 v84,9.5 85.34,8.16 85.34,7.45 85.97,6.82 86.85,6.82 87.53,7.5 v91,7.5 | v78,13.5 74,13.5 v72,15.5 | U3.32 65.8,21.7 v65,22.5 65,22.4 63.78,21.18 63.78,20.67 U3.30 U3.29 U3.28
N$64  (via drill 0.4)
  Top 0.203: Q7.3 59.89,5.21 v59.6,5.5
  Bottom 0.203: U3.61 58.64,11.65 58.64,10.99 57.11,9.46 57.11,7.75 57,7.63 57,7.5 57.29,7.21 58.29,7.21 58.71,6.79 58.71,6.39 v59.6,5.5
N$65  (via drill 0.4)
  Top 0.203: Q7.1 63.9,1.74 63.9,5.5 v63,5.5
  Bottom 0.203: v63,5.5 62.41,4.91 61,4.91 61,5.12 57.52,8.6 57.52,9.29 59.21,10.98 U3.60
N$66
  Top 0.203: Q7.4 53.52,1.74 C66.1 51.68,3.58 R39.2
N$67  (via drill 0.4)
  Top 0.203: C65.1 47.51,8.83 R39.1 48.48,4.56 v52,4.56 | v63,3.5 62.59,3.91 61.98,3.91 61.51,3.44 Q7.2
  Bottom 0.203: v63,3.5 53.06,3.5 v52,4.56
N$69  (via drill 0.4)
  Top 0.203: v55,7.5 56,6.5 57,6.5 57.71,7.21 58.89,7.21 60.29,5.81 v61.31,5.81
  Bottom 0.203: v55,7.5 55,8.5 57.71,11.21 U3.63 | v61.31,5.81 62.31,5.81 62.71,6.21 63.29,6.21 63.71,5.79 65,4.5 66.31,4.5 R26.1 68.02,6.21
N$70  (via drill 0.4)
  Top 0.203: v70,13.5 70,14.5 69,15.5 v67.01,15.5 v67,15.51
  Bottom 0.203: R28.1 70.68,14.18 v70,13.5 | U3.41 65.47,15.84 65.98,15.84 66.31,15.51 v67,15.51
N$71  (via drill 0.4)
  Top 0.203: v69.99,11.49 72,9.48 72,7.5 73.53,7.5 R27.1 | v65.25,10.51 66.5,10.51 v66.8,10.8
  Bottom 0.203: U3.50 64.28,11.65 64.28,11.14 64.46,10.96 64.8,10.96 v65.25,10.51 | v69.99,11.49 68.56,11.49 67.29,10.21 | 67.17,10.09 67.29,10.21 | v66.8,10.8 67.29,10.31 67.29,10.21
RD_N
  Bottom 0.203: C119.2 94,27.48 95.11,26.36 J12.4
RD_P
  Top 0.203: C118.2 87.92,24.23 87.92,24.07 87.54,23.69 87.54,23.04 87.24,22.74 87.24,22.36 87.08,22.36 86.49,21.78 86.49,20.94 87.08,20.36 87.91,20.36 88.5,20.94 88.5,21.78 88.39,21.89 88.66,22.15 88.66,22.74 88.35,23.04 88.35,23.36 88.57,23.58 89.79,22.36 90.45,22.36 91.04,21.78 91.04,21.2 91.3,21.2 91.72,20.78 91.72,20.43 92.88,19.27 93.43,19.82 94.26,19.82 94.85,19.24 94.85,18.82 J12.3
RTN  (via drill 0.4)
  Top 0.203: R86.2 100.39,43.1 100.39,44.58 100,44.96 v100,47.5 98.01,49.49 C128.2 | R86.2 97.7,40.42 R85.2 | R86.2 99.53,42.06 U12.8 95.99,38.81 95.99,39.5 95.81,39.67 95.16,39.67 94.98,39.5 94.98,38.81 U12.6 94.83,40.65 U12.17
  Bottom 0.203: R87.2 98.14,47.5 v100,47.5
RX_FILTER  (via drill 0.4)
  Top 0.203: v84,7.5 R78.2 82.78,14.42 R79.2 | v82,4.51 81.08,5.42 v80.08,5.42
  Bottom 0.203: v84,7.5 82.15,7.5 v80.08,5.42 | v82,4.51 83.42,4.51 C121.1
RX_N  (via drill 0.4)
  Top 0.203: v82,16.5 81,15.5 R79.1 77.07,14.5 L1.1 | L1.1 66.45,25.12 64.96,25.12 64.78,25.3 64.78,25.39 64.67,25.5 v64,25.5 | v64,28.5 65.52,28.5 U1.5 | v68,9.5 67,8.5 67,8.48 66.84,8.32 66.59,8.32 66.18,7.91 66.18,7.66 65.5,6.98 65.48,6.98 65.07,6.57 65.07,6.54 65.02,6.5 65.02,6.64 64.61,7.05 64.44,7.05 63.87,7.63 v63.86,7.63 | v73,13.5 73,16.5 72.67,16.83 72.26,17.24 71.99,17.51 L1.1
  Bottom 0.203: v82,16.5 82,23 C119.1 | v64,25.5 v64,28.5 | v68,9.5 69,9.5 v73,13.5 | U3.53 62.83,11.6 62.83,11.16 62.92,11.07 62.92,10.99 63,10.91 63,9.99 63.19,9.79 63.19,9.21 63,9.01 63,8.49 v63.86,7.63
RX_P  (via drill 0.4)
  Top 0.203: C118.1 81.92,24.48 81.71,24.7 81.71,24.79 81.29,25.21 80.71,25.21 80.29,24.79 80.29,24.48 76,24.48 76,23.5 75,22.5 73,22.5 72,21.5 v71,21.5 | v68,12.5 68,10.43 v66.96,9.39 | 78.9,9.39 v79,9.49 80.99,7.5 R78.1 | v73,12.51 v72.99,12.5 v71,12.5
  Bottom 0.203: U3.52 63.28,11.65 63.28,11.14 63.36,11.06 63.36,10.13 63.55,9.94 63.55,8.95 64,8.5 64,8.28 64.13,8.28 64.52,7.9 64.52,7.36 64.33,7.17 64.46,7.04 65.58,7.04 65.64,6.98 66.07,6.98 66.48,6.57 66.48,6.5 67.25,6.5 67.25,6.98 67.43,7.16 68.66,7.16 69,7.5 67.16,9.34 67,9.34 v66.96,9.39 | v68,12.5 | v71,21.5 69.71,20.21 69.29,19.79 68,18.5 68.5,18 68.29,17.79 68.29,17.21 69.78,15.72 69.78,14.28 69.71,14.21 69.29,13.79 v68,12.5 | v79,9.49 75.98,12.51 v73,12.51 | v71,12.5 v68,12.5
RX_P1  (via drill 0.4)
  Top 0.203: U1.12 72.9,25.6 v73,25.5 | v75,27.5 75,27.65 R9.2
  Bottom 0.203: v73,25.5 v75,27.5
SD_CLK
  Top 0.203: J2.10 26.49,59.88 26.49,60.89 26.28,61.09 21.71,61.09 21.41,61.4 19.1,61.4 19,61.5 19,65.45 RN43.1
SD_CMD  (via drill 0.4)
  Top 0.203: J2.12 27.09,59.64 27.09,58.5 27.09,58.45 27.09,58.39 v27.99,57.49 v27.98,57.5 | v23,64.5 v21,64.5 | v18,62.5 17.29,61.79 RN42.7
  Bottom 0.203: v23,64.5 23,61.5 27.01,57.49 v27.99,57.49 | v21,64.5 19,62.5 v18,62.5
SD_DAT0
  Top 0.203: RN43.5 18.3,67.75 18.64,67.75 19,67.38 19,66.03 19.41,65.62 19.41,62.4 20,61.8 21.58,61.8 21.88,61.5 28,61.5 28.41,61.09 J2.16
SD_DAT1
  Top 0.203: RN43.7 18.3,68.55 18.64,68.55 20,67.18 20,63.5 21,62.5 29,62.5 29.01,62.49 J2.18
SD_DAT2  (via drill 0.4)
  Top 0.203: RN42.3 19.31,60.19 v20,59.5 | v22.99,53.44 23.29,53.74 23.29,53.79 24,54.5 27,54.5 28.29,55.79 28.71,56.21 29.71,56.21 30.21,56.71 J2.22
  Bottom 0.203: v20,59.5 20.24,59.26 20.24,54.87 21.37,53.74 22.69,53.74 v22.99,53.44
SD_DAT3  (via drill 0.4)
  Top 0.203: RN42.5 21.24,60.99 21.54,60.69 21.81,60.69 v22.97,59.53 | v26,57.5 v27,56.5 | v31,57.5 30.81,57.69 J2.24
  Bottom 0.203: v22.97,59.53 25,57.5 v26,57.5 | v27,56.5 27.12,56.61 30.11,56.61 v31,57.5
TVCC  (via drill 0.4)
  Top 0.203: v6,19.5 6,19.65 L7.2 7.94,25.45 U9.3 6.53,25.45 6.46,25.39 5.54,25.39 4.89,26.04 4.89,27.62 C68.1 3.66,28.85 C73.1
  Bottom 0.203: v6,19.5 8.09,17.41 8.09,17.04 8.68,16.45 12.59,16.45 J1.A01 J1.B01 16.74,14.84 20.5,11.07 20.5,9.6 U8.3
TX_N  (via drill 0.4)
  Top 0.203: v62,7.34 63,6.34 64.31,6.34 64.31,4.13 R80.2 66.85,3.13 v67,3.28 | v94,2.5 94,5.5 v95,6.5
  Bottom 0.203: U3.56 61.14,11.65 61.14,7.34 v62,7.34 | 71.29,2.21 71.71,1.79 72.29,1.79 72.71,2.21 72.71,2.28 73.42,2.28 73.42,2.21 73.59,2.04 80.46,2.04 80.71,1.79 81.29,1.79 81.5,2 81.71,1.79 82.29,1.79 82.59,2.09 83.28,2.09 83.58,2.39 84.49,2.39 84.59,2.5 v94,2.5 | v95,6.5 95,18.7 95.43,19.14 95.43,19.21 95.99,19.77 96.07,19.77 J12.2 | v67,3.28 67.22,3.5 70,3.5 71.29,2.21 | 71.29,2.21
TX_P  (via drill 0.4)
  Top 0.203: v62,8.3 62.2,8.3 63,7.5 63,6.85 63.15,6.7 64.46,6.7 64.67,6.49 64.67,5.83 65,5.5 66.42,5.5 66.71,5.79 68.71,5.79 70.37,4.13 R81.1 70.42,3.48 71,3.48 71.17,3.31 71.17,2.44 71.29,2.33 71.29,2.21 71.71,1.79 71.83,1.79 72,1.62 | 71.88,1.62 72,1.62 | 72,1.62 75.19,1.62 75.19,2.96 75.36,3.13 76.72,3.13 76.89,2.96 76.89,1.62 v98.12,1.62 98.92,2.42 98.92,5.64 99.57,5.64 99.75,5.82 99.75,6.82 100.45,6.82 101.08,7.45 101.08,8.33 100.51,8.9 101.08,9.48 101.08,10.36 100.89,10.55 101.67,11.33 101.67,13.61 101.47,13.81 102.57,14.91 102.57,16.13 101.7,17 100.71,17 100.71,17.79 100.29,18.21 99.71,18.21 99.29,17.79 99.29,17.21 99.98,16.52 99.66,16.19 99.49,16.36 98.92,16.36 J12.1
  Bottom 0.203: U3.55 61.78,11.72 61.78,8.52 v62,8.3
USB0_N  (via drill 0.4)
  Top 0.203: 54.72,8.22 54.71,8.21 | 54.71,8.21 54.29,7.79 v53.99,7.49 | v67,20.5 64.25,20.5 56.62,12.88 56.12,12.38 55.62,11.88 55.71,11.79 55.71,11.21 55.29,10.79 54.71,10.79 54.62,10.88 v52.12,8.38 | v71,23.5 v74,23.5 | v76,32.47 76,40.09 80.41,40.09 80.71,39.79 81.29,39.79 81.71,40.21 81.71,40.79 81.29,41.21 80.71,41.21 80.41,40.91 76,40.91 76,45.5 78,47.5 78,49.5 77.31,50.19 J2.167 | v59.93,8.22 59.92,8.21 56.71,8.21 56.71,8.5 56.29,8.91 55.71,8.91 55.29,8.5 55.29,8.21 54.71,8.21
  Bottom 0.203: U3.58 60.21,8.49 v59.93,8.22 | v53.99,7.49 53.1,8.38 v52.12,8.38 | v67,20.5 70,23.5 v71,23.5 | v74,23.5 76,25.5 v76,32.47
USB0_P  (via drill 0.4)
  Top 0.203: v59,9.5 61.78,9.5 61.78,9.79 62.19,10.21 62.78,10.21 63.19,9.79 63.19,9.5 64.29,9.5 64.29,9.54 63.95,9.54 63.53,9.96 63.53,10.54 63.95,10.96 64.7,10.96 64.96,11.22 65.54,11.22 65.8,10.96 66.09,10.96 66.09,11.09 66.5,11.51 67.09,11.51 67.35,11.25 67.59,11.5 | 67.59,10.6 67.59,11.5 | 67.59,11.5 67.59,11.9 67.29,12.21 67.29,12.79 67.71,13.21 68.29,13.21 68.71,12.79 68.71,12.21 68.41,11.9 68.41,10.26 68.32,10.18 68.71,9.79 68.71,9.5 69.29,9.5 69.29,9.21 69.71,8.79 70.29,8.79 70.5,9 v71,8.5 | v75,14.5 75,13.5 73.71,12.21 73.29,11.79 v72,10.5 | v80.64,23.49 80.64,23.15 79.28,21.79 78.67,22.4 78.67,22.83 78.26,23.24 77.67,23.24 77.26,22.83 77.26,22.24 77.67,21.83 78.1,21.83 78.59,21.33 78.59,21.1 v77.99,20.5 | v81,29.5 v81,33.5 | v85.01,39.5 v85,39.5 84.71,39.21 84.29,38.79 v83,37.5 | J2.165 76.71,48.22 v74.99,46.5
  Bottom 0.203: U3.59 59.71,10.21 v59,9.5 | v71,8.5 72,9.5 v72,10.5 | v75,14.5 77.99,17.49 v77.99,20.5 | v81,29.5 80.64,29.14 80.64,28.86 80.71,28.79 80.71,28.21 80.64,28.14 80.64,25.43 80.87,25.21 81.29,25.21 81.71,24.79 81.71,24.21 81.29,23.79 80.64,23.79 v80.64,23.49 | v81,33.5 81,35.5 v83,37.5 | v74.99,46.5 80.49,41 80.71,41.21 81.29,41.21 81.59,40.91 83.17,40.91 83.87,40.21 84.29,40.21 84.71,39.79 84.71,39.5 v85.01,39.5
USB2_N  (via drill 0.4)
  Top 0.203: v48,12.5 49,12.5 50,11.5 v55,11.5
  Bottom 0.203: U3.1 55.91,12.41 v55,11.5 | v48,12.5 20,12.5 16.65,15.85 15.86,15.85 14.71,17 14.71,18.19 14.43,18.47 12.77,18.47 11.76,17.46 J1.A02
USB2_P  (via drill 0.4)
  Top 0.203: v51,13.5 v50.99,13.51 v50.99,15.51
  Bottom 0.203: J1.A03 10.09,17.46 10.09,17.88 10.68,18.47 11.52,18.47 11.86,18.13 12.6,18.88 14.6,18.88 14.78,18.7 15.86,19.77 17.48,19.77 18.63,18.62 18.63,17.46 50.04,17.46 51,16.5 50.99,16.49 v50.99,15.51 | v51,13.5 51.71,14.21 54,14.21 54,12.5 55.42,12.5 55.74,12.82 55.91,12.82 55.94,12.84 56.45,12.84 U3.2
USB3_N  (via drill 0.4)
  Top 0.203: J1.B02 11.44,14.5 12.59,14.5 12.59,14.01 12.77,13.83 14.43,13.83 14.61,14.01 14.61,14.5 v19,14.5
  Bottom 0.203: v19,14.5 20.09,13.41 48.29,13.41 48.29,13.79 48.71,14.21 50.7,14.21 51.71,15.22 51.71,15.21 | 51.83,15.09 51.71,15.21 | 51.71,15.21 53.29,15.21 53.89,14.61 54.17,14.61 54.41,14.38 54.41,13.09 54.59,12.91 55.26,12.91 55.57,13.22 55.74,13.22 55.77,13.25 55.84,13.25 55.94,13.34 56.45,13.34 U3.3
USB3_P  (via drill 0.4)
  Top 0.203: v19.8,10.5 21.8,8.5 v31,8.5 | v54.46,15.5 53.46,14.5 53.5,14.5 53.5,14 | 53.5,14 | v49,13.5 50.59,11.91 53.5,11.91 53.5,13 53.7,13.21 53.7,13.79 53.5,14
  Bottom 0.203: v49,13.5 49,11.5 46,8.5 v31,8.5 | J1.B03 13.44,10.5 15.52,10.5 15.86,10.17 17.48,10.17 17.82,10.5 v19.8,10.5 | v54.46,15.5 55,14.96 55,13.5 55.28,13.5 55.41,13.63 55.58,13.63 55.6,13.66 55.68,13.66 55.77,13.75 55.84,13.75 55.94,13.84 56.45,13.84 U3.4
USBDM4  (via drill 0.4)
  Top 0.203: v70,31.47 70.47,31 70.47,29.21 70.65,29.03 70.67,29.03 U1.16 | v59,29.47 55.54,29.47 54.25,28.17 49.67,28.17 v49,27.5 | v43,28.5 43.08,28.58 L2.1
  Bottom 0.203: v70,31.47 63.41,31.47 63.29,31.59 61.12,31.59 v59,29.47 | v49,27.5 44,27.5 v43,28.5
USBDP4
  Top 0.203: U1.13 76.39,26.26 R14.2
VDD18CORE  (via drill 0.4)
  Top 0.203: v35,36.5 35.29,36.21 35.29,35.21 37.71,32.79 39,31.5 39,30.5 41,30.5 41.29,30.21 41.29,29.21 43,27.5 48,27.5 v55,20.5 59,20.5 v61,22.5 | 8.48,50.65 C60.1 | v66,23.5 66,23.08 68.58,20.5 v69,20.5 | v8.85,47.35 8.85,47.05 C14.1 8.56,45.5 v8.15,45.5 | 8.48,50.65 8.63,50.5 v10,50.5 10,52.72 C61.1 | C62.1 4.73,44.77 v5,44.5 | 6,50.4 v6,49.5 | v8.08,49.51 8.08,50.25 8.48,50.65
  Bottom 0.203: U3.15 56.45,19.48 55.94,19.48 55.76,19.66 55.76,19.74 v55,20.5 | v35,36.5 27,44.5 9.15,44.5 v8.15,45.5 | U3.38 65.47,17.48 65.98,17.48 66.16,17.66 v69,20.5 | v66,23.5 62,23.5 v61,22.5 | v10,50.5 8.85,49.35 v8.85,47.35 7.85,47.35 v5,44.5 | v6,49.5 v8.07,49.5 v8.08,49.51
Y_LED+
  Top 0.203: R74.2 98.94,8.61 100.13,9.8 J12.L3

## Text on the board
bPlace: APRIL TAG v1.1 | RoboRacing